# EasyEDA Pro project tachyon.eprj, board Backing
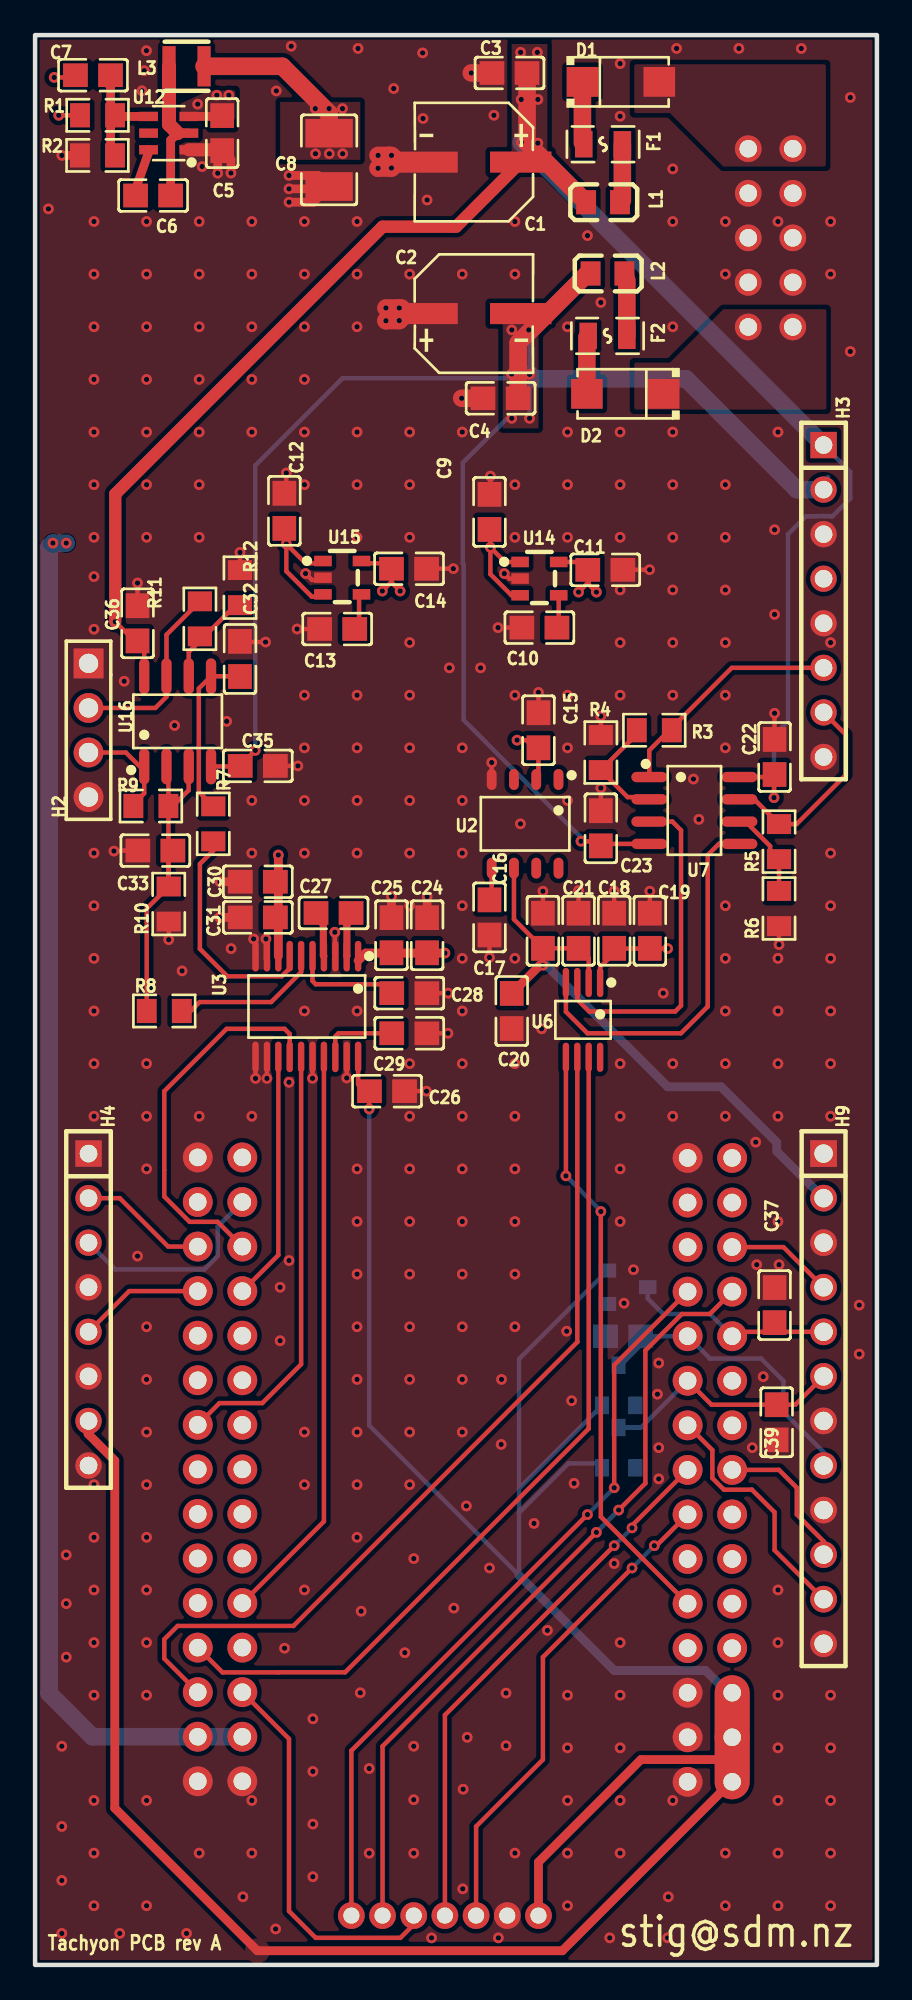
[diagram p10: board, top side]
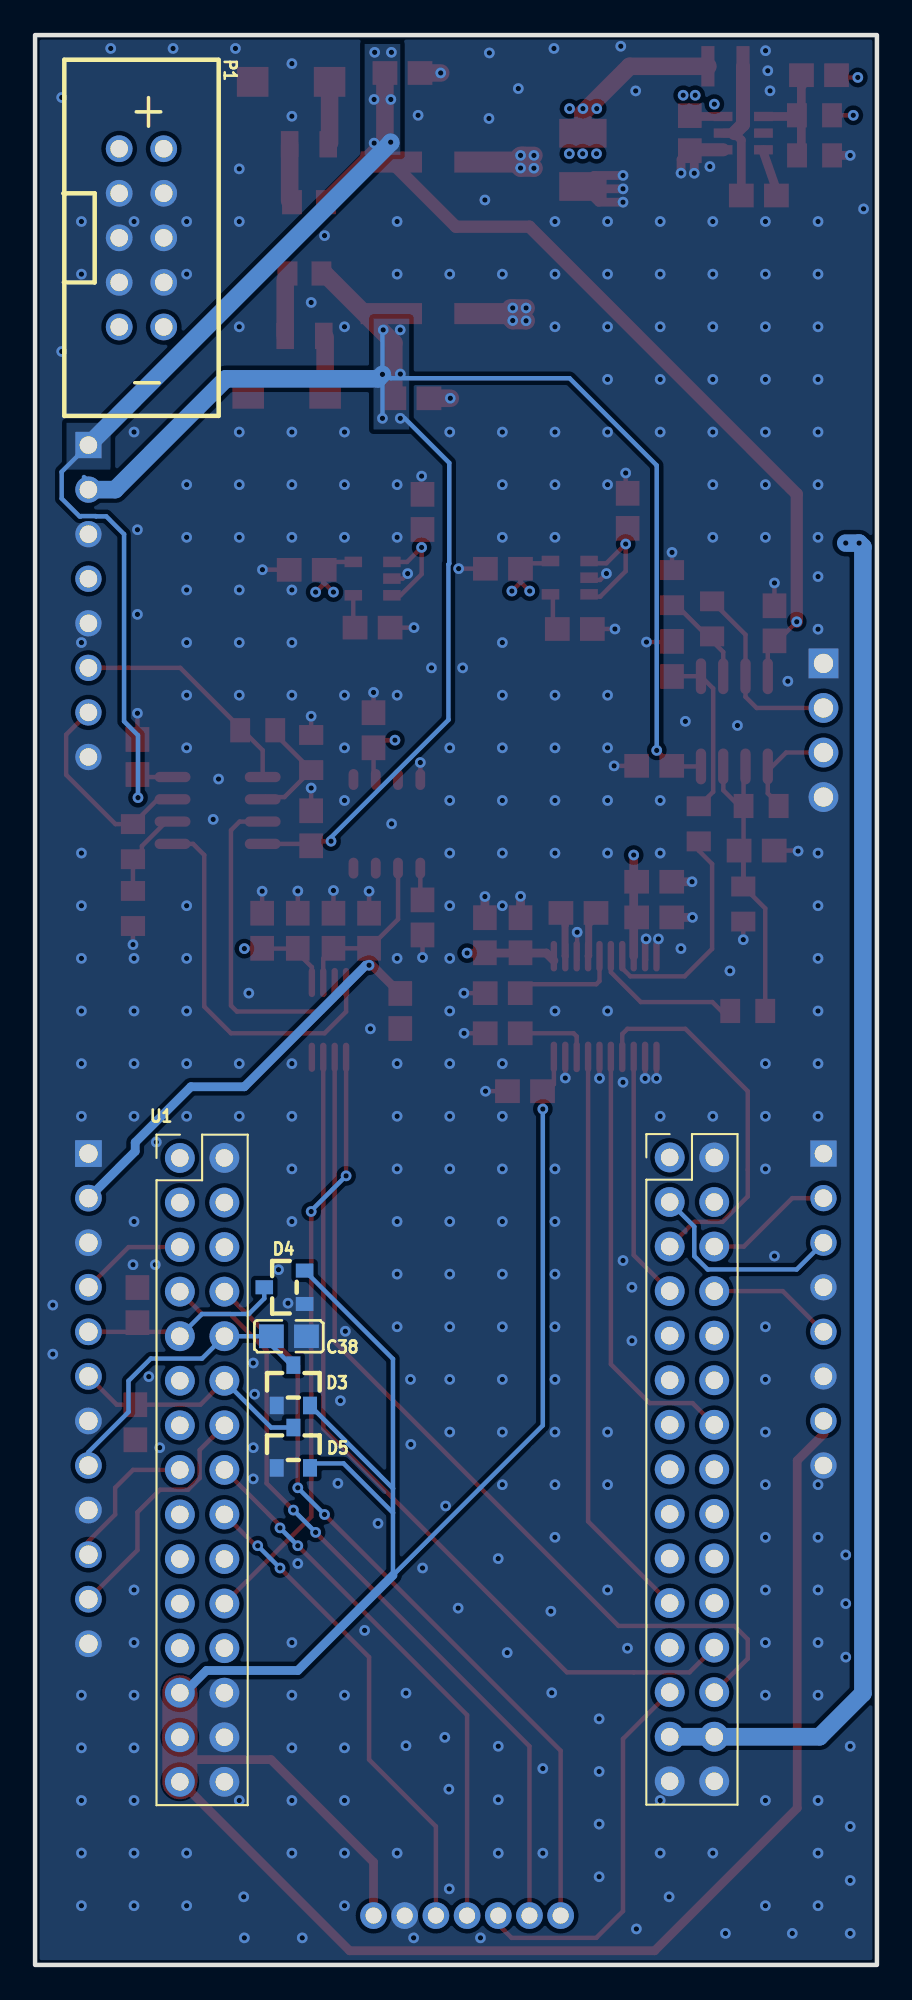
[diagram p11: board, bottom side, seen from below]

Outline 48 x 110 mm; copper layers: Top Layer, L2 GND Plane, L3 Power Plane, Bottom Layer. Coordinates in mm from the lower left corner of the outline.
Outline path: rectangle 0,110 48,0
Stack: Top Layer 0.035mm Outer layer thickness 1oz / Dielectric1 0.2104mm 7628 RC49% 8.6mil / L2 GND Plane 0.0152mm Inner layer thickness / Dielectric2 1.065mm 1.1mm H/HOZ Copper / L3 Power Plane 0.0152mm Inner layer thickness / Dielectric3 0.2104mm 7628 RC49% 8.6mil / Bottom Layer 0.035mm Outer layer thickness 1oz

## Design rules (mm)
template: Custom Config
spacing copperThickness1oz (default): track to track 0.102, other pairs 0.152 to 0.3
spacing copperThickness2oz: track to track 0.203, other pairs 0.152 to 0.3
track width copperThickness1oz (default): min 0.127, default 0.254, max 2.54
track width copperThickness2oz: min 0.203, default 0.254, max 2.54
differential pair differentialPair (default): width min 0.127, default 0.254, max 2.54; gap min 0.152, default 0.152
via viaSize (default): diameter min 0.5, default 0.61, max 10; hole min 0.3, default 0.305, max 6.3
net GND uses copperRegion1
net +12V uses copperRegion1
net -12V uses copperRegion1
net +5V uses copperRegion1
net +3V3 uses copperRegion1
net -12VEURO uses copperRegion1
pour e370 uses copperRegion1

## Placement (name value [footprint] x y rotation side)
C1  100uF  [CAP-SMD_BD6.3-L6.6-W6.6-LS7.2-FD]  25.02 102.76 180 top
C2  100uF  [CAP-SMD_BD6.3-L6.6-W6.6-LS7.2-FD]  25.02 94.12 0 top
C3  100nF  [C0805]  27.05 107.84 0 top
C4  100nF  [C0805]  26.54 89.3 180 top
C5  10uF  [C0805]  10.67 104.41 90 top
C6  100nF  [C0805]  6.73 100.86 180 top
C7  68pF  [C0805]  3.3 107.71 180 top
C8  47uF  [C1210]  16.76 102.89 90 top
C9  1uF  [C0805]  25.91 82.82 270 top
C10  10nF  [C0805]  28.76 76.22 0 top
C11  1uF  [C0805]  32.51 79.52 180 top
C12  1uF  [C0805]  14.21 82.88 270 top
C13  10nF  [C0805]  17.22 76.15 0 top
C14  1uF  [C0805]  21.32 79.58 180 top
C15  10uF  [C0805]  28.7 70.38 270 top
C16  10uF  [C0805]  28.96 58.95 270 top
C17  100nF  [C0805]  25.91 59.71 90 top
C18  1uF  [C0805]  33.02 58.95 90 top
C19  100nF  [C0805]  35.05 58.95 270 top
C20  1uF  [C0805]  27.18 54.37 90 top
C21  100nF  [C0805]  30.99 58.95 270 top
C22  100nF  [C0805]  42.16 68.85 90 top
C23  100nF  [C0805]  32.26 64.79 90 top
C24  100nF  [C0805]  22.35 58.69 270 top
C25  10uF  [C0805]  20.32 58.69 270 top
C26  100nF  [C0805]  20.07 49.8 0 top
C27  470nF  [C0805]  17.02 59.96 0 top
C28  1uF  [C0805]  21.34 55.39 180 top
C29  1uF  [C0805]  21.34 53.1 180 top
C30  100nF  [C0805]  12.7 61.74 0 top
C31  10uF  [C0805]  12.7 59.71 0 top
C32  2.2nF  [C0805]  11.68 74.44 270 top
C33  2.2nF  [C0805]  6.86 63.52 180 top
C35  100nF  [C0805]  12.7 68.34 0 top
C36  100nF  [C0805]  5.84 76.47 90 top
C37  100nF  [C0805]  42.16 37.61 270 top
C38  2.2nF  [C0805]  33.53 35.83 0 bottom
C39  100nF  [C0805]  42.28 30.93 90 top
D1  SS14  [SMA_L4.4-W2.6-LS5.0-RD]  33.4 107.33 0 top
D2  SS14  [SMA_L4.4-W2.6-LS5.0-RD]  33.66 89.55 180 top
D3  BAT54SLT1G  [SOT-23_L2.9-W1.3-P1.90-LS2.4-BR]  33.27 33.04 270 bottom
D4  BAT54SLT1G  [SOT-23_L2.9-W1.3-P1.90-LS2.4-BR]  33.78 38.63 180 bottom
D5  BAT54SLT1G  [SOT-23_L2.9-W1.3-P1.90-LS2.4-BR]  33.27 29.48 270 bottom
F1  SMD0805-050-30V  [F0805]  32.38 103.78 0 top
F2  SMD0805-020-30V  [F0805]  32.64 92.86 0 top
H2  YZT1069-06115-04025-01  [HDR-TH_4P-P2.54-V-M-1]  3.05 70.38 270 top
H3  HC-PZ254-11.5L-1x8PZ  [HDR-TH_8P-P2.54-V-M]  44.96 77.74 270 top
H4  HC-PZ254-11.5L-1x8PZ  [HDR-TH_8P-P2.54-V-M]  3.05 37.36 270 top
H9  YZT1069-06115-12025-01  [HDR-TH_12P-P2.54-V-M]  44.96 32.28 270 top
L1  BLM21AG601SN1D  [L0805]  32.38 100.47 180 top
L2  BLM21AG601SN1D  [L0805]  32.64 96.41 180 top
L3  4.7uH  [IND-SMD_L2.5-W2.0_MPB252012T]  8.64 108.22 0 top
NOREF  -  [Pad_e1958]  23.37 2.81 180 top
NOREF#2  -  [Pad_e1960]  18.03 2.81 180 top
NOREF#3  -  [Pad_e1957]  25.15 2.81 180 top
NOREF#4  -  [Pad_e1956]  26.92 2.81 180 top
NOREF#5  -  [Pad_e1962]  21.59 2.81 180 top
NOREF#6  -  [Pad_e1966]  28.7 2.81 180 top
NOREF#7  -  [Pad_e1961]  19.81 2.81 180 top
P1  2.54-2*5P Eurorack Power  [IDC-TH_10P-P2.54_C5665]  41.93 98.44 270 bottom
R1  97.6kΩ  [R0805]  3.56 105.43 180 top
R2  13.3kΩ  [R0805]  3.56 103.14 0 top
R3  30kΩ  [R0805]  35.31 70.38 0 top
R4  10kΩ  [R0805]  32.26 69.11 270 top
R5  30kΩ  [R0805]  42.42 64.03 90 top
R6  10kΩ  [R0805]  42.42 60.22 90 top
R7  470Ω  [R0805]  10.16 65.04 270 top
R8  470Ω  [R0805]  7.37 54.37 0 top
R9  10kΩ  [R0805]  6.6 66.06 180 top
R10  6.8kΩ  [R0805]  7.62 60.47 90 top
R11  10kΩ  [R0805]  9.4 76.73 90 top
R12  6.8kΩ  [R0805]  11.68 78.5 270 top
U1  WeAct-STM32F405RGT6  [WeAct STM32F405RGT6]  25.15 25.93 180 bottom
U2  REF5025IDR  [SOIC-8_L4.9-W3.9-P1.27-LS6.0-BL-4]  27.94 65.04 180 top
U3  PCM5102APWR  [TSSOP-20_L6.5-W4.4-P0.65-LS6.4-BL]  15.49 54.63 180 top
U6  DAC8552IDGKR  [VSSOP-8_L3.0-W3.0-P0.65-LS5.0-BL]  31.24 53.87 180 top
U7  OPA1642AIDR  [SOIC-8_L4.9-W3.9-P1.27-LS6.0-BL]  37.59 65.8 270 top
U12  TPS54202DDCR  [SOT-23-6_L2.9-W1.6-P0.95-LS2.8-BL]  7.62 104.41 90 top
U14  TPS7A2033PDBVR  [SOT-23-5_L2.9-W1.6-P0.95-LS2.8-BR]  28.76 79.02 180 top
U15  TPS7A2033PDBVR  [SOT-23-5_L2.9-W1.6-P0.95-LS2.8-BR]  17.51 79.07 180 top
U16  OPA1642AIDR  [SOIC-8_L4.9-W3.9-P1.27-LS6.0-BL]  8.13 70.88 0 top

## Footprints (pads in the part's own frame, mm; a bottom-side part is the same pattern mirrored in y, then rotated)
C0805
  rect 1.41x1.35 smd: 1(-1,0) 2(1,0)
C1210
  rect 1.635x2.7 smd: 1(-1.518,0) 2(1.518,0)
CAP-SMD_BD6.3-L6.6-W6.6-LS7.2-FD
  rect 3.5x1.2 smd: 1(-2.67,0) 2(2.67,0)
F0805
  rect 1x1.5 smd: 1(-1.1,0) 2(1.1,0)
HDR-TH_4P-P2.54-V-M-1
  rect 1.7x1.7 hole 1.1: 1(-3.81,0)
  round 1.7 hole 1.1: 2(-1.27,0) 3(1.27,0) 4(3.81,0)
HDR-TH_8P-P2.54-V-M
  rect 1.5x1.5 hole 1: 1(-8.89,0)
  round 1.5 hole 1: 2(-6.35,0) 3(-3.81,0) 4(-1.27,0) 5(1.27,0) 6(3.81,0) 7(6.35,0) 8(8.89,0)
HDR-TH_12P-P2.54-V-M
  rect 1.524x1.524 hole 1.05: 1(-13.97,0)
  round 1.524 hole 1.05: 2(-11.43,0) 3(-8.89,0) 4(-6.35,0) 5(-3.81,0) 6(-1.27,0) 7(1.27,0) 8(3.81,0) 9(6.35,0) 10(8.89,0) 11(11.43,0) 12(13.97,0)
IDC-TH_10P-P2.54_C5665
  round 1.524 hole 1: 1(-5.08,-1.27) 2(-5.08,1.27) 3(-2.54,-1.27) 4(-2.54,1.27) 5(0,-1.27) 6(0,1.27) 7(2.54,-1.27) 8(2.54,1.27) 9(5.08,-1.27) 10(5.08,1.27)
IND-SMD_L2.5-W2.0_MPB252012T
  rect 0.75x2.3 smd: 1(-1,0) 2(1,0)
L0805
  rect 1.133x1.377 smd: 1(-0.966,0) 2(0.966,0)
Pad_e1956
  round 1.524 hole 0.914: 1(0,0)
Pad_e1957
  round 1.524 hole 0.914: 2(0,0)
Pad_e1958
  round 1.524 hole 0.914: 3(0,0)
Pad_e1960
  round 1.524 hole 0.914: 3(0,0)
Pad_e1961
  round 1.524 hole 0.914: 2(0,0)
Pad_e1962
  round 1.524 hole 0.914: 1(0,0)
Pad_e1966
  round 1.524 hole 0.914: 1(0,0)
R0805
  rect 1.133x1.377 smd: 1(-1,0) 2(1,0)
SMA_L4.4-W2.6-LS5.0-RD
  rect 1.8x1.7 smd: 1(-2.192,0) 2(2.192,0)
SOIC-8_L4.9-W3.9-P1.27-LS6.0-BL
  oval 0.588x2.045 smd: 1(-1.905,-2.57) 2(-0.635,-2.57) 3(0.635,-2.57) 4(1.905,-2.57) 5(1.905,2.57) 6(0.635,2.57) 7(-0.635,2.57) 8(-1.905,2.57)
SOIC-8_L4.9-W3.9-P1.27-LS6.0-BL-4
  oval 0.559x1.194 smd: 1(-1.905,-2.527) 2(-0.635,-2.527) 3(0.635,-2.527) 4(1.905,-2.527) 5(1.905,2.527) 6(0.635,2.527) 7(-0.635,2.527) 8(-1.905,2.527)
SOT-23-5_L2.9-W1.6-P0.95-LS2.8-BR
  rect 1x0.6 smd: 1(1.1,-0.95) 2(1.1,0) 3(1.1,0.95) 4(-1.1,0.95) 5(-1.1,-0.95)
SOT-23-6_L2.9-W1.6-P0.95-LS2.8-BL
  rect 0.532x1.072 smd: 1(-0.95,-1.149) 2(0,-1.149) 3(0.95,-1.149) 4(0.95,1.149) 5(0,1.149) 6(-0.95,1.149)
SOT-23_L2.9-W1.3-P1.90-LS2.4-BR
  rect 1x0.8 smd: 1(1.15,-0.95) 2(1.15,0.95) 3(-1.15,0)
TSSOP-20_L6.5-W4.4-P0.65-LS6.4-BL
  oval 0.364x1.742 smd: 1(-2.925,-2.871) 2(-2.275,-2.871) 3(-1.625,-2.871) 4(-0.975,-2.871) 5(-0.325,-2.871) 6(0.325,-2.871) 7(0.975,-2.871) 8(1.625,-2.871) 9(2.275,-2.871) 10(2.925,-2.871) 11(2.925,2.871) 12(2.275,2.871) 13(1.625,2.871) 14(0.975,2.871) 15(0.325,2.871) 16(-0.325,2.871) 17(-0.975,2.871) 18(-1.625,2.871) 19(-2.275,2.871) 20(-2.925,2.871)
VSSOP-8_L3.0-W3.0-P0.65-LS5.0-BL
  oval 0.364x1.662 smd: 1(-0.975,-2.131) 2(-0.325,-2.131) 3(0.325,-2.131) 4(0.975,-2.131) 5(0.975,2.131) 6(0.325,2.131) 7(-0.325,2.131) 8(-0.975,2.131)
WeAct STM32F405RGT6
  round 1.7 hole 1: 1(-14.6,20.07) 2(-12.06,20.07) 3(-14.6,17.53) 4(-12.06,17.53) 5(-14.6,14.99) 6(-12.06,14.99) 7(-14.6,12.45) 8(-12.06,12.45) 9(-14.6,9.91) 10(-12.06,9.91) 11(-14.6,7.37) 12(-12.06,7.37) 13(-14.6,4.83) 14(-12.06,4.83) 15(-14.6,2.29) 16(-12.06,2.29) 17(-14.6,-0.25) 18(-12.06,-0.25) 19(-14.6,-2.79) 20(-12.06,-2.79) 21(-14.6,-5.33) 22(-12.06,-5.33) 23(-14.6,-7.87) 24(-12.06,-7.87) 25(-14.6,-10.41) 26(-12.06,-10.41) 27(-14.6,-12.95) 28(-12.06,-12.95) 29(-14.6,-15.49) 30(-12.06,-15.49) 31(13.33,20.1) 32(15.87,20.1) 33(13.33,17.56) 34(15.87,17.56) 35(13.33,15.02) 36(15.87,15.02) 37(13.33,12.48) 38(15.87,12.48) 39(13.33,9.94) 40(15.87,9.94) 41(13.33,7.4) 42(15.87,7.4) 43(13.33,4.86) 44(15.87,4.86) 45(13.33,2.32) 46(15.87,2.32) 47(13.33,-0.22) 48(15.87,-0.22) 49(13.33,-2.76) 50(15.87,-2.76) 51(13.33,-5.3) 52(15.87,-5.3) 53(13.33,-7.84) 54(15.87,-7.84) 55(13.33,-10.38) 56(15.87,-10.38) 57(13.33,-12.92) 58(15.87,-12.92) 59(13.33,-15.46) 60(15.87,-15.46)

## Nets
As in the schematic, except:
+3V3: C26.1 D3.2 D4.2 D5.2 H4.7 NOREF#6.1 U1.25 U1.27 U1.29 U3.20
GND: C1.2 C2.1 C3.1 C4.2 C5.1 C8.1 C9.1 C10.1 C11.1 C12.1 C13.1 C14.1 C15.1 C16.1 C17.1 C18.2 C19.1 C20.1 C21.1 C22.2 C23.2 C24.1 C25.1 C26.2 C28.1 C29.1 C30.1 C31.1 C32.1 C33.2 C35.2 C36.2 C37.1 C38.1 C39.1 D3.1 D4.1 D5.1 H2.1 H2.4 H3.3 H3.5 H3.8 H4.1 H4.4 H4.6 H4.8 H9.1 H9.3 H9.7 H9.9 H9.12 NOREF#4.1 P1.3 P1.4 P1.5 P1.6 P1.7 P1.8 R2.1 R4.1 R6.1 R10.1 R12.1 U1.2 U1.26 U1.28 U1.30 U1.32 U1.59 U1.60 U2.4 U3.3 U3.9 U3.10 U3.11 U3.12 U3.16 U3.19 U12.1 U14.2 U15.2
OLED-DC: NOREF#7.2 U1.7
OLED-RES: NOREF#2.3 U1.8
OLED-SPI-CS: NOREF#5.1 U1.55
OLED-SPI-MOSI: NOREF#3.2 U1.18
OLED-SPI-SCLK: NOREF.3 U1.16

Pads without a net: U1 1 3 4 6 11 13 17 19 20 21 23 24 31 34 39 40 41 42 43 45 46 47 48 49 50 52 53; U2 1 3 7 8; U6 8; U12 5

## Via types
v1: diameter 0.61, hole 0.305, Top Layer to Bottom Layer, 431 vias

## Routing (per net, layer and track width the routed paths; a pad name or vN(x,y) marks a point on that pad's centre or on a via; arc(x,y) is an arc through that point)
+3V3: length 166.7
  Top Layer w0.254: C26.1 19.05,49.79 v1(19.05,48.79) ; U3.20 18.42,50.19 18.81,49.8
  Top Layer w0.5: 39.37,11.7 34.54,11.7 28.7,5.86 NOREF#6.1 ; U1.29 39.69,10.44 30.06,0.81 12.67,0.81 4.54,8.94 4.54,28.75 3.02,30.27 3.02,30.98 H4.7
  Top Layer w2: U1.25 U1.27 U1.29
  Bottom Layer w0.254: D3.2 27.59,27.16 ; 27.59,27.16 27.59,25.77 ; 27.59,27.16 27.59,34.54 D4.2 ; 27.59,25.77 27.59,22.21 19.05,30.75 v1(19.05,48.79) ; 27.59,25.77 30.41,28.59 32.32,28.59
  Bottom Layer w0.5: U1.25 39.49,15.77 39.24,15.77 38.23,16.78 33.02,16.78 27.59,22.21
+3V3_AUDIO: length 15.1
  Top Layer w0.254: 20.32,78.83 C14.2 ; 20.32,78.83 20.32,78.8 v1(20.81,78.31) ; 20.32,78.83 v1(19.8,78.31) ; 20.29,79.45 20.18,79.45 19.74,79.89 18.47,79.89
  Top Layer w0.5: v1(23.37,57.68) 18.85,57.68 18.42,57.25 ; v1(13.87,63.26) U3.8
+3V3_PREC: length 12.4
  Top Layer w0.254: 31.57,78.83 31.57,79.53 31.12,79.97 29.86,79.97 ; 31.57,78.83 v1(30.99,78.25) ; 31.57,78.83 31.57,78.69 v1(32,78.25) ; v1(36.07,57.93) 33.27,57.93 32.22,56.87 U6.1 ; v1(27.48,69.81) 28.01,69.81 28.7,69.12 28.7,67.7 U2.2
+5V: length 104.1
  Top Layer w0.254: U14.3 27.59,78 27.52,78.07 27.16,78.07 25.96,79.27 v1(25.96,80.8) ; 16.27,77.99 15.78,77.99 14.33,79.44 v1(14.33,80.99) ; v1(1.09,107.59) 2.31,107.59 ; 27.66,79.97 26.79,79.97 v1(25.96,80.8) ; v1(1.35,105.43) R1.2 ; v1(14.33,80.99) 15.42,79.89 16.27,79.89 ; v1(14.33,80.99) 14.33,81.5 ; v1(25.96,80.8) 25.96,81.83
  Top Layer w1: C8.2 16.76,105.56 14.1,108.22 L3.2
  Bottom Layer w1: v1(1.78,81.04) v1(1.02,81.04) 0.8,80.83 0.8,15.47 3.27,13.01 U1.58 U1.57
  vias: v1(15.98,105.81) v1(15.99,103.24) v1(16.76,105.81) v1(16.78,103.24) v1(17.53,105.81) v1(17.54,103.24)
+12V: length 103.8
  Top Layer w0.254: v1(42.13,66.53) 42.13,67.45 41.88,67.71 U7.8 ; 6.22,73.45 6.22,75.09 C36.1 5.66,75.47 v1(4.57,76.56)
  Top Layer w0.5: U12.3 10.87,105.36
  Top Layer w0.7: v1(4.57,76.56) 4.57,83.84 19.81,99.08 24.01,99.08 C1.1
  Top Layer w1: 31.42,100.47 28.05,103.84 C3.2
  Bottom Layer w0.254: H3.1 46.48,85.11 46.48,83.58 45.47,82.57 45.4,82.57 45.38,82.58 44.53,82.58 44.52,82.57 43.94,82.57 42.93,81.55 42.93,70.88 42.13,70.09 v1(42.13,66.53)
  Bottom Layer w1: v1(27.72,103.9) 27.72,103.87 H3.1
  vias: v1(9.27,106.06) v1(10.36,106.57) v1(11.05,106.57) v1(27.68,109.02) v1(27.72,106.33) v1(28.64,109.02) v1(28.67,106.33) v1(28.67,103.84)
-12V: length 103.4
  Top Layer w0.254: v1(31.13,64.05) 31.13,64.04 32.26,64.04 ; U16.4 11.67,68.31 C35.1 11.7,68.37 v1(12.56,69.23) ; U7.4 32.4,63.9
  Top Layer w1: C4.1 27.54,92.45 31.5,96.41 L2.2
  Bottom Layer w0.254: v1(12.56,69.23) 12.56,85.47 17.53,90.44 27.72,90.44 27.94,90.66 v1(28.19,90.66) ; v1(27.18,88.16) 26.92,88.16 24.38,85.62 24.38,79.88 24.43,79.83 24.43,70.96 31.13,64.27 v1(31.13,64.05) ; v1(28.19,90.66) v1(28.19,88.16) ; v1(28.19,90.66) 28.19,93.15 v1(28.15,93.2) ; 45.21,84.81 44.5,84.09
  Bottom Layer w1: H3.2 43.43,84.09 37.12,90.41 28.45,90.41 v1(28.19,90.66)
  vias: v1(27.18,93.2) v1(27.17,90.68)
GND: length 73.3
  Top Layer w0.254: v1(33.02,61.21) C18.2 ; v1(42.42,58.16) R6.1 ; v1(26.75,79.3) 27.04,79.02 U14.2 ; 17.77,50.55 U3.19 ; 34.8,59.69 C19.1 v1(35.05,61.2) ; C29.1 v1(23.54,53.1) ; R10.1 v1(7.62,58.44) ; v1(13.16,58.48) 13.16,57.3 13.22,57.25 ; v1(23.55,55.39) C28.1 ; U3.12 v1(13.22,50.53) ; C22.2 v1(42.16,71.34) ; v1(13.14,75.4) 11.72,75.4 C32.1 ; 16.27,78.94 15.79,78.94 v1(15.42,79.31) ; C33.2 4.53,63.52 v1(4.5,63.49) ; C10.1 v1(26.4,76.22) ; C35.2 v1(14.99,68.34) ; C16.1 v1(28.96,61.2) ; v1(28.7,72.53) 28.7,71.12 ; U2.4 v1(26.03,68.54) ; v1(23.85,79.59) 22.33,79.59 C14.1 ; v1(12.46,58.48) 12.57,58.37 12.57,57.25 ; v1(5.84,78.77) C36.2 ; v1(11.68,80.51) R12.1 ; C8.1 16.63,101.24 ; U3.11 v1(12.57,50.53) ; v1(25.91,57.42) C17.1 ; 25.96,83.83 v1(25.96,84.86) ; v1(17.09,58.86) 17.09,57.27 17.12,57.25 ; v1(22.32,49.8) C26.2 ; 14.33,83.75 v1(14.33,85.04) ; 33.57,79.53 v1(35.04,79.53) ; U3.16 v1(15.82,50.53) ; 32.26,66.04 v1(32.26,67.08) ; C13.1 v1(14.94,76.15) ; R4.1 v1(32.26,71.18) ; C21.1 v1(30.99,61.24)
  Top Layer w0.5: v1(14.48,102) 16.14,102 C8.1 ; C25.1 v1(20.32,60.91) ; R2.1 v1(1.52,103.14) ; v1(14.48,101.24) 16.63,101.24 15.87,100.47 v1(14.48,100.47) ; v1(10.41,102.13) 10.41,103.16 C5.1 11.17,102.91 v1(11.17,102.13) ; v1(22.35,60.9) C24.1 ; C30.1 v1(10.54,61.74) ; C31.1 v1(10.52,59.71)
  Top Layer w0.75: U12.1 10.87,103.46
  Top Layer w1: 20.57,102.76 20.57,102.68 v1(20.32,102.42) 19.57,102.42 v1(19.56,102.41) ; 20.57,102.76 20.57,102.89 20.38,103.08 ; 20.57,102.76 22.35,102.76 ; v1(20.77,94.45) v1(20,94.45) ; v1(20.77,94.45) 20.89,94.45 ; v1(20.77,94.45) 21.15,94.07 ; v1(19.56,103.14) 20.19,103.14 20.38,103.08 ; 20.38,103.08 v1(20.32,103.14) ; 21.15,94.07 21.1,94.07 v1(20.77,93.73) 20.02,93.73 v1(20,93.72) ; 21.15,94.07 23.05,94.07 ; v1(24.32,89.3) 25.5,89.3 ; v1(24.87,107.84) C3.1
  vias: v1(0.76,100.09) v1(1.52,12.46) v1(1.52,7.89) v1(1.52,4.81) v1(1.52,1.8) v1(1.78,23.37) v1(1.78,20.59) v1(1.78,17.54) v1(3.36,99.37) v1(3.36,96.37) v1(3.36,93.37) v1(3.36,90.37) v1(3.36,87.37) v1(3.36,84.37) v1(3.36,81.37) v1(3.36,79.14) v1(3.36,76.14) v1(3.36,63.37) v1(3.36,60.37) v1(3.36,57.37) v1(3.36,54.37) v1(3.36,51.37) v1(3.36,48.37) v1(3.36,27.37) v1(3.36,24.37) v1(3.36,21.37) v1(3.36,18.37) v1(3.36,15.37) v1(3.36,9.37) v1(3.36,6.37) v1(3.36,3.37) v1(4.83,1.8) v1(5.08,73.17) v1(5.84,40.4) v1(6.1,106.83) v1(6.22,107.97) v1(6.35,109.11) v1(6.36,99.37) v1(6.36,96.37) v1(6.36,93.37) v1(6.36,90.37) v1(6.36,87.37) v1(6.36,84.37) v1(6.36,81.37) v1(6.36,51.37) v1(6.36,48.37) v1(6.36,45.37) v1(6.36,36.37) v1(6.36,33.37) v1(6.36,30.37) v1(6.36,27.37) v1(6.36,24.37) v1(6.36,21.37) v1(6.36,18.37) v1(6.36,15.37) v1(6.36,9.37) v1(6.36,3.37) v1(7.95,70.65) v1(8.38,56.66) v1(8.64,1.8) v1(9.36,99.37) v1(9.36,96.37) v1(9.36,93.37) v1(9.36,90.37) v1(9.36,87.37) v1(9.36,84.37) v1(9.36,81.37) v1(9.36,48.37) v1(9.36,6.37) v1(9.53,102.51) v1(10.92,70.88) v1(11.18,57.93) v1(11.85,3.88) v1(12.36,99.37) v1(12.36,96.37) v1(12.36,93.37) v1(12.36,90.37) v1(12.36,87.37) v1(12.36,66.37) v1(12.36,63.37) v1(12.36,48.37) v1(12.36,9.37) v1(12.36,6.37) v1(13.72,2.05) v1(13.75,106.82) v1(13.97,38.63) v1(13.97,35.58) v1(14.22,18.05) v1(14.48,50.31) v1(14.48,40.15) v1(14.6,109.37) v1(15.36,99.37) v1(15.36,96.37) v1(15.36,93.37) v1(15.36,90.37) v1(15.36,87.37) v1(15.36,84.37) v1(15.36,72.37) v1(15.36,69.37) v1(15.36,66.37) v1(15.36,63.37) v1(15.36,54.37) v1(15.36,30.37) v1(15.36,27.37) v1(15.36,21.37) v1(15.84,14.03) v1(15.84,11.03) v1(15.84,8.03) v1(15.84,5.03) v1(17.77,50.55) v1(18.41,109.24) v1(18.36,99.37) v1(18.36,96.37) v1(18.36,93.37) v1(18.36,87.37) v1(18.36,84.37) v1(18.36,81.37) v1(18.36,72.37) v1(18.36,69.37) v1(18.36,66.37) v1(18.36,63.37) v1(18.36,54.37) v1(18.36,45.37) v1(18.36,42.37) v1(18.36,39.37) v1(18.36,36.37) v1(18.36,33.37) v1(18.36,30.37) v1(18.36,27.37) v1(18.36,24.37) v1(18.54,15.51) v1(18.59,20.16) v1(19.05,11.19) v1(19.05,6.37) v1(20.45,106.95) v1(21.08,17.8) v1(21.36,96.37) v1(21.36,87.37) v1(21.36,84.37) v1(21.36,81.37) v1(21.36,75.37) v1(21.36,72.37) v1(21.36,69.37) v1(21.36,66.37) v1(21.36,63.37) v1(21.36,60.37) v1(21.36,51.37) v1(21.36,48.37) v1(21.36,45.37) v1(21.36,42.37) v1(21.36,39.37) v1(21.36,36.37) v1(21.36,33.37) v1(21.36,30.37) v1(21.36,27.37) v1(21.59,23.16) v1(21.59,12.46) v1(21.59,9.42) v1(21.59,6.37) v1(22.1,108.98) v1(22.12,105.25) v1(22.35,100.6) v1(22.61,1.54) v1(23.62,73.93) v1(23.88,20.34) v1(24.36,96.37) v1(24.36,87.37) v1(24.36,69.37) v1(24.36,66.37) v1(24.36,63.37) v1(24.36,60.37) v1(24.36,57.37) v1(24.36,54.37) v1(24.36,51.37) v1(24.36,48.37) v1(24.36,45.37) v1(24.36,42.37) v1(24.36,39.37) v1(24.36,36.37) v1(24.36,33.37) v1(24.36,30.37) v1(24.41,10.02) v1(24.38,4.34) v1(24.59,26.16) v1(24.64,12.97) v1(25.4,73.93) v1(25.91,22.62) v1(26.16,105.43) v1(26.42,1.54) v1(26.6,33.37) v1(26.58,29.67) v1(26.85,15.49) v1(26.85,12.49) v1(27.36,99.37) v1(27.36,96.37) v1(27.36,84.37) v1(27.36,81.37) v1(27.36,72.37) v1(27.36,57.37) v1(27.36,51.37) v1(27.36,48.37) v1(27.36,45.37) v1(27.36,42.37) v1(27.36,39.37) v1(27.36,36.37) v1(27.36,6.37) v1(27.67,65.04) v1(28.45,25.16) v1(28.88,53.36) v1(29.21,19.07) v1(30.31,36.12) v1(30.36,93.37) v1(30.36,87.37) v1(30.36,84.37) v1(30.36,81.37) v1(30.36,72.37) v1(30.36,69.37) v1(30.36,66.37) v1(30.36,15.37) v1(30.36,12.37) v1(30.36,9.37) v1(30.36,6.37) v1(30.36,3.37) v1(30.59,32.16) v1(30.73,27.45) v1(31.5,98.57) v1(32.26,94.76) v1(32.77,1.54) v1(33.02,22.88) v1(33.36,108.37) v1(33.36,105.37) v1(33.36,87.37) v1(33.36,84.37) v1(33.36,81.37) v1(33.36,78.37) v1(33.36,75.37) v1(33.36,72.37) v1(33.36,51.37) v1(33.36,48.37) v1(33.36,45.37) v1(33.36,42.37) v1(33.36,18.37) v1(33.36,15.37) v1(33.36,12.37) v1(33.36,9.37) v1(33.36,6.37) v1(33.58,37.72) v1(34.12,39.63) v1(35.48,32.53) v1(35.56,34.31) v1(35.56,29.48) v1(35.56,27.7) v1(35.81,55.39) v1(36.1,3.88) v1(36.07,1.54) v1(36.36,102.37) v1(36.36,99.37) v1(36.36,93.37) v1(36.36,87.37) v1(36.36,84.37) v1(36.36,81.37) v1(36.36,78.37) v1(36.36,75.37) v1(36.36,72.37) v1(36.36,51.37) v1(36.36,48.37) v1(36.36,9.37) v1(36.58,109.24) v1(37.54,67.59) v1(37.85,65.3) v1(39.36,99.37) v1(39.36,96.37) v1(39.36,84.37) v1(39.36,81.37) v1(39.36,78.37) v1(39.36,75.37) v1(39.36,72.37) v1(39.36,69.37) v1(39.36,60.37) v1(39.36,57.37) v1(39.36,54.37) v1(39.36,51.37) v1(39.36,48.37) v1(39.36,6.37) v1(39.36,3.37) v1(40.13,109.24) v1(40.89,29.48) v1(41.09,46.9) v1(41.15,39.91) v1(41.52,33.53) v1(42.16,81.81) v1(42.16,76.98) v1(42.36,99.37) v1(42.36,87.37) v1(42.36,57.37) v1(42.36,54.37) v1(42.36,51.37) v1(42.36,48.37) v1(42.36,42.37) v1(42.42,39.91) v1(42.36,21.37) v1(42.36,18.37) v1(42.36,15.37) v1(42.36,12.37) v1(42.36,9.37) v1(42.36,6.37) v1(42.36,3.37) v1(43.69,109.24) v1(45.36,99.37) v1(45.36,96.37) v1(45.36,75.37) v1(45.36,63.37) v1(45.36,60.37) v1(45.36,57.37) v1(45.36,54.37) v1(45.36,51.37) v1(45.36,48.37) v1(45.36,15.37) v1(45.36,12.37) v1(45.36,9.37) v1(45.36,6.37) v1(45.36,3.37) v1(46.48,106.44) v1(46.48,91.97) v1(46.99,37.61) v1(46.99,34.82)
A-OUT-L: length 6
  Top Layer w0.254: H2.3 5.18,69.11 6.22,68.06 ; 6.22,68.06 6.22,66.78 5.6,66.16 ; 6.22,68.06 6.22,68.31
A-OUT-R: length 10.9
  Top Layer w0.254: H2.2 6.86,71.65 7.49,72.28 U16.7 7.49,75.82 R11.2
CLK-IN: length 17
  Bottom Layer w0.254: H9.8 44.96,29.23 42.67,31.51 42.67,33.29 41.4,34.56 38.48,34.56 U1.10 35.04,35.84 33.27,34.07
CV-IN-A: length 11.7
  Top Layer w0.254: H9.5 40,36.09 U1.9
  Bottom Layer w0.254: U1.9 38.48,37.1 35.81,37.1 34.93,37.98 D4.3
CV-IN-B: length 14
  Top Layer w0.254: H9.6 43.34,31.93 C39.2 38.57,31.93 U1.12
  Bottom Layer w0.254: U1.12 34.54,30.63 D5.3
CV-OUT-A: length 13.4
  Top Layer w0.254: U7.1 35.02,69.23 39.72,73.93 H3.6
CV-OUT-B: length 11.9
  Top Layer w0.254: H3.7 46.23,70.12 46.23,67.84 43.42,65.03 R5.2 41,66.44 U7.7
DAC-SPI-CS: length 34
  Top Layer w0.254: U1.22 32.26,25.54 v1(32.26,42.94) ; U6.5 v1(30.27,44.98)
  Bottom Layer w0.254: v1(30.27,44.98) 32.26,42.98 v1(32.26,42.94)
DAC-SPI-MOSI: length 49.8
  Top Layer w0.254: U1.54 10.69,16.68 13.86,16.68 13.86,16.68 17.68,16.68 31.57,30.57 31.57,51.73
DAC-SPI-SCLK: length 50.6
  Top Layer w0.254: U1.56 7.37,17.46 7.37,18.56 8.13,19.32 14.73,19.32 30.92,35.51 U6.6
GATE-OUT-A: length 14.1
  Top Layer w0.254: U1.14 38.62,29.34 38.62,27.75 39.28,27.09 40.88,27.09 42.16,25.8 42.16,23.64 H9.11
GATE-OUT-B: length 8.6
  Top Layer w0.254: H9.10 44.96,24.15 43.43,25.67 43.43,27.2 42.41,28.22 U1.15
I2S3_BCK: length 14.2
  Top Layer w0.254: U3.13 13.87,40.46 U1.37
I2S3_SD: length 21.9
  Top Layer w0.254: 14.52,51.5 14.52,53.06 14.22,53.36 10.92,53.36 7.37,49.8 7.37,43.8 8.81,42.36 10.41,42.36 U1.35
I2S3_WS: length 24.6
  Top Layer w0.254: 15.17,51.5 15.17,34.24 12.95,32.02 10.51,32.02 U1.44
OLED-DC: length 44.8
  Top Layer w0.254: U1.7 38.47,37.1 36.88,37.1 34.8,35.02 34.8,27.45 v1(33.27,25.93) ; v1(32,24.66) 19.81,12.46 NOREF#7.2
  Bottom Layer w0.254: v1(33.27,25.93) v1(32,24.66)
OLED-RES: length 43.5
  Top Layer w0.254: U1.8 33.02,34.19 v1(33.02,27.2) ; NOREF#2.3 18.03,12.21 v1(31.5,25.67)
  Bottom Layer w0.254: v1(33.02,27.2) v1(31.5,25.67)
OLED-SPI-CS: length 22.1
  Top Layer w0.254: U1.55 14.48,12.88 14.48,3.07 16,1.54 20.83,1.54 21.59,2.3 NOREF#5.1
OLED-SPI-MOSI: length 27.9
  Top Layer w0.254: v1(35.31,23.89) 35.42,23.89 U1.18 ; NOREF#3.2 25.15,7.89 28.96,11.7 28.96,17.54 v1(34.04,22.62)
  Bottom Layer w0.254: v1(35.31,23.89) v1(34.04,22.62)
OLED-SPI-SCLK: length 31.1
  Top Layer w0.254: U1.16 34.04,25.05 v1(34.04,24.91) ; NOREF.3 23.37,14.24 v1(33.02,23.89)
  Bottom Layer w0.254: v1(34.04,24.91) v1(33.02,23.89)
U12-BOOT: length 2.6
  Top Layer w0.5: 5.65,100.98 6.51,103.42 U12.6
U12-FB: length 6.5
  Top Layer w0.5: U12.4 4.63,105.36 R1.1 ; 4.3,102.89 4.31,102.89 4.31,107.08 4.05,107.33
U12-SW: length 8.4
  Top Layer w0.5: C6.1 7.73,104.02 8.13,104.41 U12.2
  Top Layer w0.8: L3.1 7.64,104.9 8.13,104.41
USR-ENC-A: length 7.4
  Top Layer w0.254: H4.2 4.83,43.71 7.59,40.95 U1.36
USR-ENC-B: length 12
  Bottom Layer w0.254: U1.33 10.41,42.08 10.41,40.4 9.65,39.64 4.57,39.64 H4.3
USR-ENC-SW: length 7.2
  Top Layer w0.254: U1.38 5.37,38.41 H4.5
USR-POT-1: length 6.2
  Top Layer w0.254: U1.5 42.67,40.92 H9.4
VREF: length 34
  Top Layer w0.254: C16.2 27.31,59.6 U2.6 ; C16.2 v1(28.96,56.98) ; C16.2 C21.2 31.57,57.37 31.57,56
  Top Layer w0.5: v1(28.96,56.98) 28.79,56.98 27.69,55.88
  Bottom Layer w0.5: H9.2 42.29,46.37 42.29,46.88 39.12,50.06 36.07,50.06 29.14,56.98 v1(28.96,56.98)
~MUTE: length 33.1
  Top Layer w0.254: U3.17 16.47,25.28 U1.51
$2N2806: length 19.3
  Top Layer w0.254: U6.3 30.92,55.02 31.6,54.34 36.49,54.34 36.83,54.68 36.83,64.68 36.34,65.17 U7.3
$2N2810: length 6.6
  Top Layer w0.254: U7.2 34.9,66.57 33.78,66.57 32.26,68.09 R4.2 34.31,70.15 R3.1
$2N2813: length 5.1
  Top Layer w0.254: R6.2 R5.1 41.91,63.53 41.91,63.77 40.51,65.17 U7.6
$2N2826: length 5.4
  Top Layer w0.254: R11.1 9.65,75.73 11.68,77.76 ; 9.4,75.47 8.76,74.84 8.76,73.45
$2N2830: length 8.5
  Top Layer w0.254: U3.6 15.17,56.59 13.46,54.88 9.38,54.88 8.62,54.12
$2N2831: length 19.3
  Top Layer w0.254: R8.1 6.37,60.22 7.6,61.45 7.6,63.52 ; R9.1 7.6,68.2 U16.2 ; R10.2 7.62,63.5 7.6,63.52 ; 7.6,63.52 7.6,65.8 8.76,66.96 8.76,68.31 8.76,68.31
$2N2832: length 13.1
  Top Layer w0.254: U3.7 14.52,56.81 14.06,56.35 10.96,56.35 9.4,57.91 9.4,62.76 10.16,63.52 R7.2
$2N2839: length 2.3
  Top Layer w0.4: U3.2 17.78,57.51 17.78,59.26 17.77,59.28 17.77,59.46 18.02,59.71
$2N2840: length 2.4
  Top Layer w0.4: U3.4 16.44,57.53 16.44,59.31 16.03,59.71 16.02,59.71
$2N2842: length 6.2
  Top Layer w0.254: C28.2 19.83,55.9 16,55.9 15.82,56.08 U3.5
$2N2847: length 9.7
  Top Layer w0.254: R7.1 9.34,66.87 9.34,72.76 U16.5 11.67,73.45 C32.2
$2N2851: length 4.5
  Top Layer w0.254: C29.2 17.3,53.1 17.12,52.92 U3.18
$2N7056: length 21.6
  Top Layer w0.254: U6.4 30.27,54.33 31.5,53.1 36.83,53.1 38.35,54.63 38.35,63.26 38.99,63.9 U7.5
$4N1443: length 3.2
  Top Layer w1: D2.2 31.46,92.78
$4N1444: length 3.5
  Top Layer w1: D1.1 31.21,103.85
$4N1447: length 3.2
  Top Layer w1: F2.2 33.74,96.02
$4N1449: length 3.2
  Top Layer w1: F1.2 33.49,100.56
$4N1457: length 1.9
  Top Layer w0.254: C17.2 26.03,60.83 U2.5
$4N3246: length 1.7
  Top Layer w0.254: 18.47,77.99 18.47,76.65 18.22,76.4
$4N3248: length 1.9
  Top Layer w0.254: U14.4 29.86,76.33 C10.2

## Copper pours and planes (outline as drawn; the poured copper is in the pictures)
12VEURO on Top Layer: 45.09,102.51 45.09,108.34 34.16,108.34 34.16,105.56 36.19,105.56 39.24,102.51
+3V3_AUDIO on L3 Power Plane: 24.37,80.09 4.56,80.09 4.56,55.7 24.37,55.7
+3V3_PREC on L3 Power Plane: 36.31,80.02 24.62,80.02 24.62,54.62 36.31,54.62
+5V on Top Layer: 13.97,106.19 18.54,106.19 18.54,102.89 13.97,102.89
+5V on L3 Power Plane: 36.52,80.34 0.41,80.34 0.41,109.75 5.49,109.75 5.49,104.22 14.96,104.22 14.96,106.69 18.44,106.69 18.44,94.95 25.85,87.09 38.66,87.09 44.71,80.03 46.23,80.03 46.23,78 38.86,78
+12V on Top Layer: 8.25,105.17 11.42,105.17 11.42,106.85 9.89,106.82 8.25,106.08
+12V on Top Layer: 27.18,109.49 29.21,109.49 29.21,102.76 27.18,102.76
+12V on Bottom Layer: 27.18,109.49 29.21,109.49 29.21,103.17 27.18,103.17
+12V on Bottom Layer: 43.69,87.9 46.21,87.9 46.21,85.23 43.69,85.23
+12V on L3 Power Plane: 5.72,109.62 5.72,104.41 14.73,104.41 14.73,106.83 18.67,106.83 18.67,98.95 27.56,98.95 29.34,100.73 29.34,109.62
-12V on Top Layer: 26.67,94.32 28.7,94.32 28.7,87.58 26.67,87.58
-12V on Bottom Layer: 26.67,93.84 28.7,93.84 28.7,87.52 26.67,87.52
-12VEURO on Top Layer: 45.12,88.66 45.12,94.38 39.24,94.38 36.19,91.33 34.16,91.33 34.16,88.66
GND on Top Layer: 0.25,109.75 47.75,109.75 47.75,0.27 0.25,0.27
GND on Bottom Layer: 0.25,109.75 47.75,109.75 47.75,0.27 0.25,0.27
GND on L2 GND Plane: 0.26,109.74 47.74,109.74 47.74,0.26 0.26,0.26
GND on L3 Power Plane: 4.32,80.03 4.32,55.39 24.38,55.39 24.38,54.37 36.46,54.37 36.49,54.34 36.49,79.69 36.58,79.77 38.61,77.74 47.75,77.74 47.75,0.27 0.25,0.27 0.25,80.03
GND on L3 Power Plane: 18.8,95.01 26.42,87.39 38.86,87.39 44.71,80.54 47.75,80.54 47.75,109.75 29.59,109.75 29.59,100.6 27.69,98.7 18.8,98.7

Small or netless copper shapes (teardrops, artwork), in the pictures only: 110 on L2 GND Plane, 1 on L3 Power Plane

## Text on the board
Bottom Silkscreen Layer: + | -
Top Silkscreen Layer: Tachyon PCB rev A | stig@sdm.nz
